# Altium schematic sheet BNO055.SchDoc
size A4; SheetNumber: 5; SheetTotal: 10
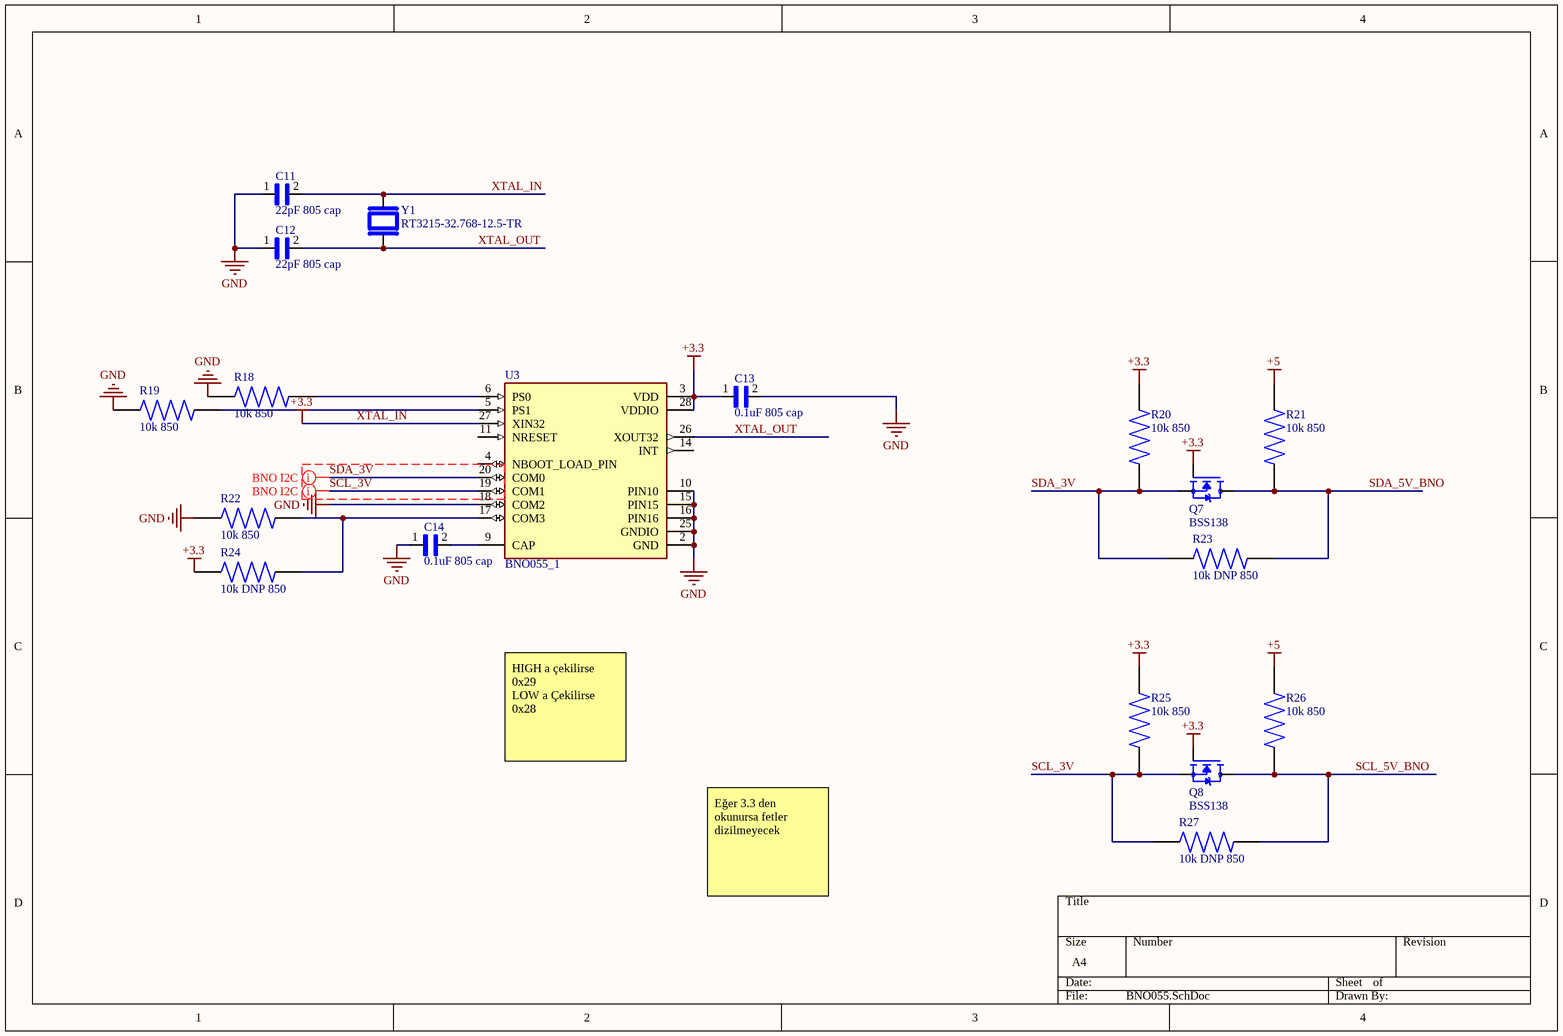
[diagram p0: BNO055.SchDoc]

## Parts
C11  22pF 805 cap  [1uF 805 Cap]
C12  22pF 805 cap  [1uF 805 Cap]
C13  0.1uF 805 cap  [1uF 805 Cap]
C14  0.1uF 805 cap  [1uF 805 Cap]
Q7  BSS138  [SOT91P240X110-3N - duplicate]
Q8  BSS138  [SOT91P240X110-3N - duplicate]
R18  10k 850  [10k 850]
R19  10k 850  [10k 850]
R20  10k 850  [10k 850]
R21  10k 850  [10k 850]
R22  10k 850  [10k 850]
R23  10k DNP 850  [10k 850]
R24  10k DNP 850  [10k 850]
R25  10k 850  [10k 850]
R26  10k 850  [10k 850]
R27  10k DNP 850  [10k 850]
U3  BNO055_1  [LGA28R50P4X10_380X520X100]
Y1  RT3215-32.768-12.5-TR  [XTAL_RT3215-32.768-12.5-TR]

## Nets
+5: R21.1 R26.1
GND: C11.1 C12.1 C13.2 C14.1 R18.1 R19.1 R22.1 U3.2(GND) U3.10(PIN10) U3.15(PIN15) U3.16(PIN16) U3.18(COM2) U3.25(GNDIO)
XTAL_IN: C11.2 C13.1 Q7.1(G) Q8.1(G) R20.1 R24.1 R25.1 U3.3(VDD) U3.27(XIN32) U3.28(VDDIO) Y1.1  [also labelled +3.3]
SCL_3V: Q8.2(S) R25.2 R27.1 U3.19(COM1)
SCL_5V_BNO: Q8.3(D) R26.2 R27.2
SDA_3V: Q7.2(S) R20.2 R23.1 U3.20(COM0)
SDA_5V_BNO: Q7.3(D) R21.2 R23.2
XTAL_OUT: C12.2 U3.26(XOUT32) Y1.2
NetC14_2: C14.2 U3.9(CAP)
NetR18_2: R18.2 U3.6(PS0)
NetR19_2: R19.2 U3.5(PS1)
NetR22_2: R22.2 R24.2 U3.17(COM3)

Not connected (* = marked no-connect by the designer): U3 4(NBOOT_LOAD_PIN) 11(NRESET) 14(INT)

## Layout directives
mark named BNO I2C: SCL_3V, SDA_3V

## Notes on the sheet
- HIGH a çekilirse 0x29
  LOW a Çekilirse 0x28
- Eğer 3.3 den okunursa fetler dizilmeyecek

## Library data of the parts
C11-C14 = 1uF 805 cap
Q7 Q8 = BSS138: N-Channel 50 V 220mA (Ta) 350mW (Ta) Surface Mount SOT-23-3; MF: onsemi; SnapEDA_Link: https://www.snapeda.com/parts/BSS138/Onsemi/view-part/?ref=snap; Package: SOT-23-3 ON Semiconductor; Value: *; MP: BSS138; Check_prices: https://www.snapeda.com/parts/BSS138/Onsemi/view-part/?ref=eda
R23 R24 R27 = 10k 850
U3 = BNO055_1: BNO055 9-axis Absolute Orientation Sensor ( SiP ) w/Sensors and Sensor Fusion; Package: None; Price: None; Value: *; MP: BNO055; Availability: Unavailable
Y1 = RT3215-32.768-12.5-TR: 32.768 kHz Â±20ppm Crystal 12.5pF 70 kOhms 2-SMD, No Lead; MF: Raltron Electronics; Package: SMD-2 Raltron Electronics; Price: None; Check_prices: https://www.snapeda.com/parts/RT3215-32.768-12.5-TR/Raltron+Electronics/view-part/?ref=eda; Value: *; SnapEDA_Link: https://www.snapeda.com/parts/RT3215-32.768-12.5-TR/Raltron+Electronics/view-part/?ref=snap; MP: RT3215-32.768-12.5-TR; Availability: In Stock; Purchase-URL: https://pricing.snapeda.com/search?q=RT3215-32.768-12.5-TR&ref=eda